# EAGLE schematic mother_board (EAGLE 9.6.0)
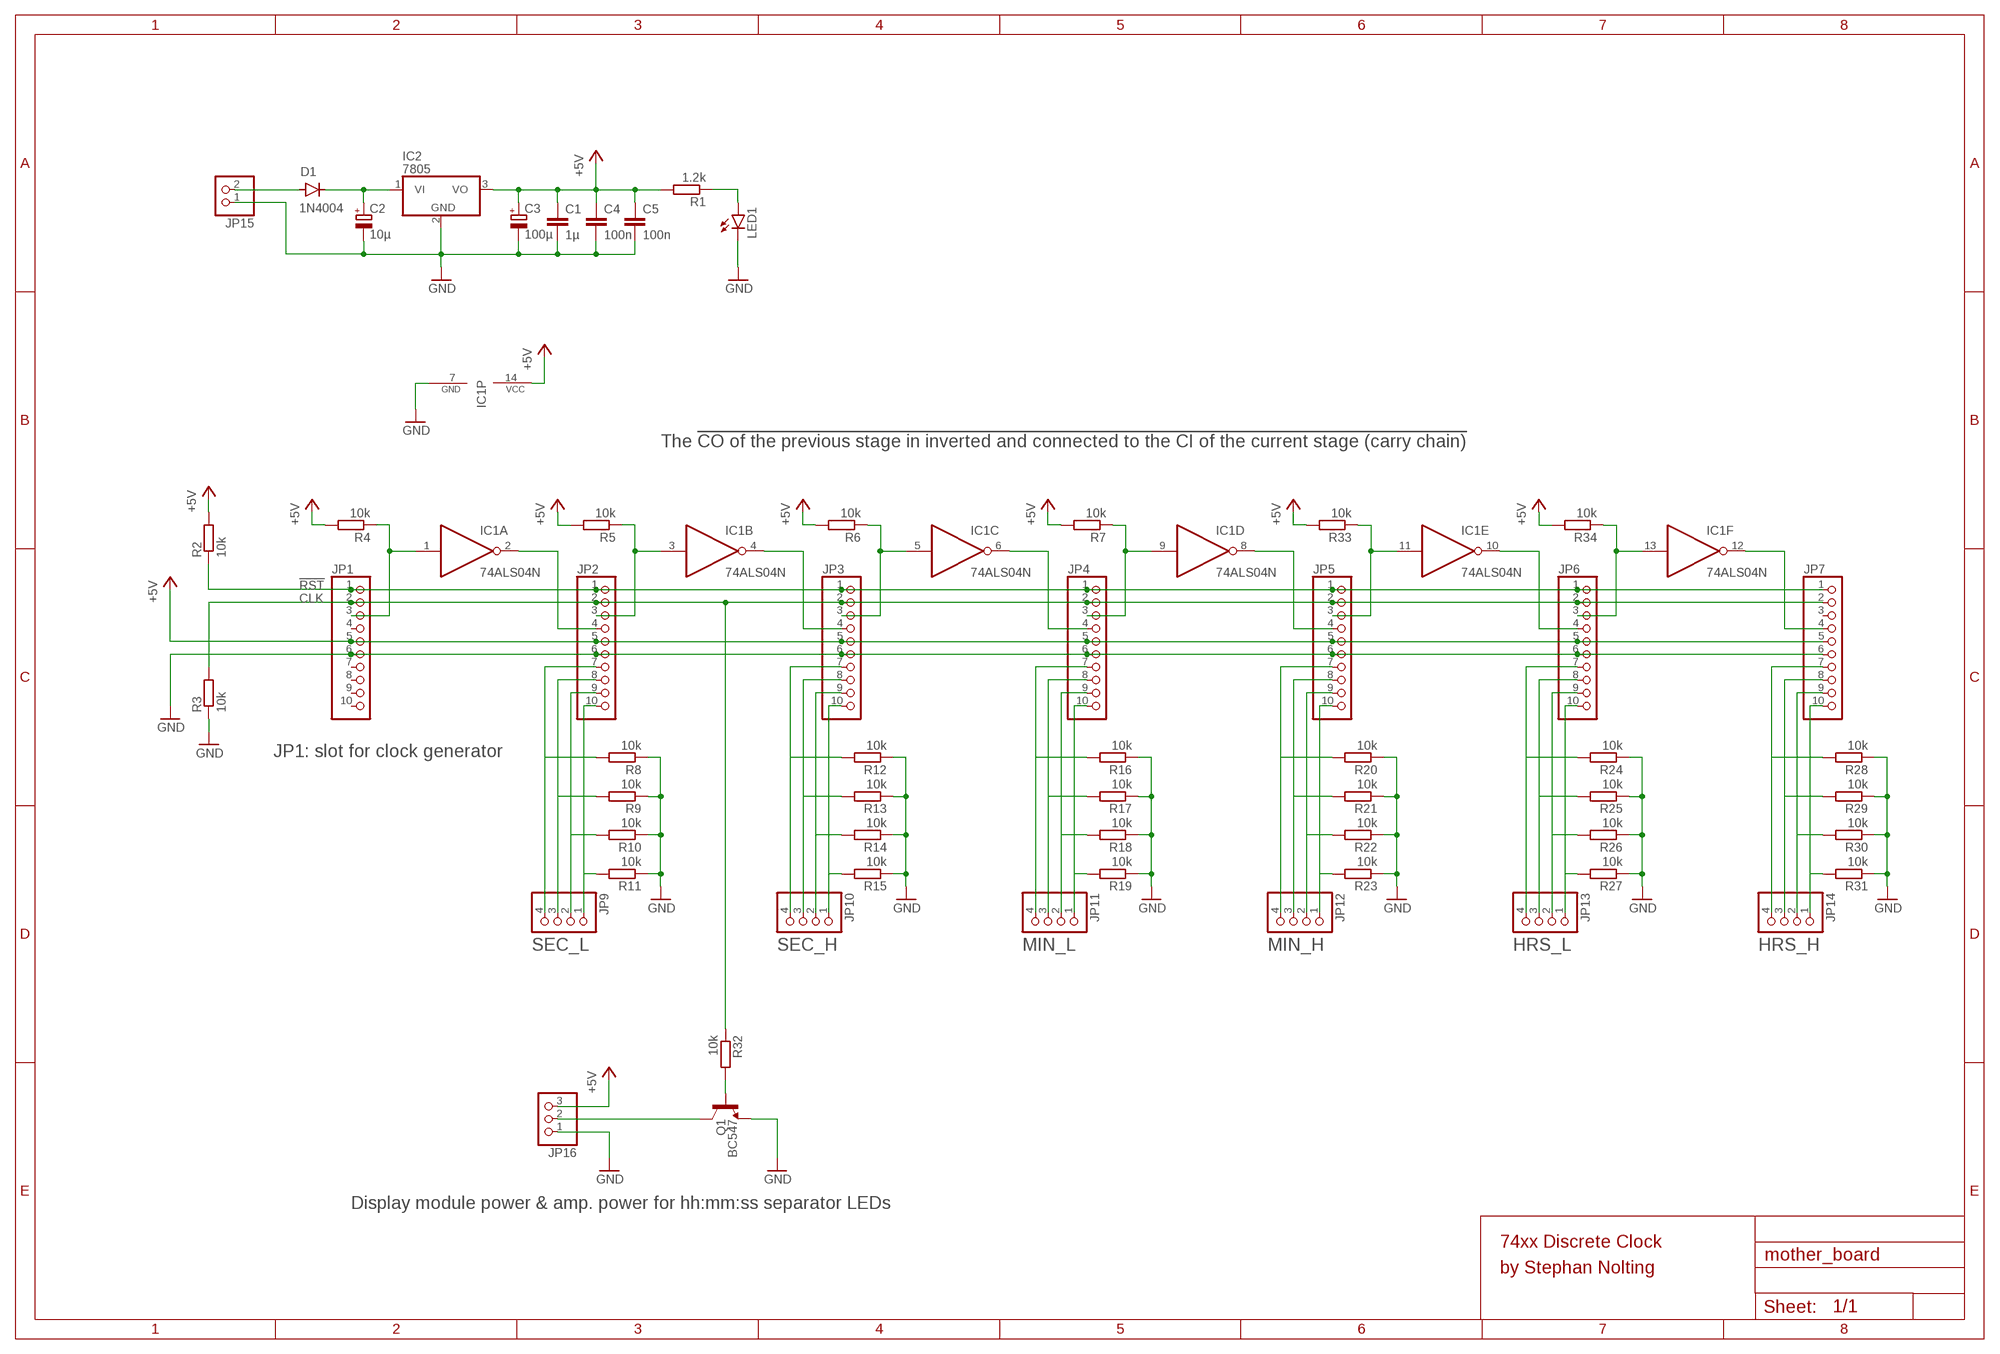
[diagram p0: schematic, sheet 1]

## Parts
C1  1µ  C-EU025-024X044  [C025-024X044]
C2  10µ  CPOL-EUE2-5  [E2-5]
C3  100µ  CPOL-EUE2-5  [E2-5]
C4  100n  C-EU025-024X044  [C025-024X044]
C5  100n  C-EU025-024X044  [C025-024X044]
D1  1N4004  [DO-41]
IC1  74ALS04N  [DIL14]
IC2  7805  788TV  [TO220V]
JP1  PINHD-1X10/90  [1X10/90]
JP2  PINHD-1X10/90  [1X10/90]
JP3  PINHD-1X10/90  [1X10/90]
JP4  PINHD-1X10/90  [1X10/90]
JP5  PINHD-1X10/90  [1X10/90]
JP6  PINHD-1X10/90  [1X10/90]
JP7  PINHD-1X10/90  [1X10/90]
JP9  PINHD-1X4  [1X04]
JP10  PINHD-1X4  [1X04]
JP11  PINHD-1X4  [1X04]
JP12  PINHD-1X4  [1X04]
JP13  PINHD-1X4  [1X04]
JP14  PINHD-1X4  [1X04]
JP15  PINHD-1X2  [1X02]
JP16  PINHD-1X3  [1X03]
LED1  LED3MM  [LED3MM]
Q1  BC547  TRANS_NPN-2N3904  [TO-92]
R1  1.2k  R-EU_0204/7  [0204/7]
R2  10k  R-EU_0204/7  [0204/7]
R3  10k  R-EU_0204/7  [0204/7]
R4  10k  R-EU_0204/7  [0204/7]
R5  10k  R-EU_0204/7  [0204/7]
R6  10k  R-EU_0204/7  [0204/7]
R7  10k  R-EU_0204/7  [0204/7]
R8  10k  R-EU_0204/7  [0204/7]
R9  10k  R-EU_0204/7  [0204/7]
R10  10k  R-EU_0204/7  [0204/7]
R11  10k  R-EU_0204/7  [0204/7]
R12  10k  R-EU_0204/7  [0204/7]
R13  10k  R-EU_0204/7  [0204/7]
R14  10k  R-EU_0204/7  [0204/7]
R15  10k  R-EU_0204/7  [0204/7]
R16  10k  R-EU_0204/7  [0204/7]
R17  10k  R-EU_0204/7  [0204/7]
R18  10k  R-EU_0204/7  [0204/7]
R19  10k  R-EU_0204/7  [0204/7]
R20  10k  R-EU_0204/7  [0204/7]
R21  10k  R-EU_0204/7  [0204/7]
R22  10k  R-EU_0204/7  [0204/7]
R23  10k  R-EU_0204/7  [0204/7]
R24  10k  R-EU_0204/7  [0204/7]
R25  10k  R-EU_0204/7  [0204/7]
R26  10k  R-EU_0204/7  [0204/7]
R27  10k  R-EU_0204/7  [0204/7]
R28  10k  R-EU_0204/7  [0204/7]
R29  10k  R-EU_0204/7  [0204/7]
R30  10k  R-EU_0204/7  [0204/7]
R31  10k  R-EU_0204/7  [0204/7]
R32  10k  R-EU_0204/7  [0204/7]
R33  10k  R-EU_0204/7  [0204/7]
R34  10k  R-EU_0204/7  [0204/7]

## Nets
!RST: JP1.1 JP2.1 JP3.1 JP4.1 JP5.1 JP6.1 JP7.1 R2.1
+5V: C1.1 C3.+ C4.1 C5.1 IC1.14(P:VCC) IC2.3(VO) JP1.5 JP2.5 JP3.5 JP4.5 JP5.5 JP6.5 JP7.5 JP16.3 R1.2 R2.2 R4.2 R5.2 R6.2 R7.2 R33.2 R34.2
CLK: JP1.2 JP2.2 JP3.2 JP4.2 JP5.2 JP6.2 JP7.2 R3.2 R32.1
GND: C1.2 C2.- C3.- C4.2 C5.2 IC1.7(P:GND) IC2.2(GND) JP1.6 JP2.6 JP3.6 JP4.6 JP5.6 JP6.6 JP7.6 JP15.1 JP16.1 LED1.K(C) Q1.1(E) R3.1 R8.1 R9.1 R10.1 R11.1 R12.1 R13.1 R14.1 R15.1 R16.1 R17.1 R18.1 R19.1 R20.1 R21.1 R22.1 R23.1 R24.1 R25.1 R26.1 R27.1 R28.1 R29.1 R30.1 R31.1
N$1: LED1.A R1.1
N$2: JP7.10 JP14.1
N$3: JP7.9 JP14.2
N$4: JP7.8 JP14.3
N$5: JP7.7 JP14.4
N$6: JP6.10 JP13.1
N$7: JP6.9 JP13.2
N$8: JP6.8 JP13.3
N$9: JP6.7 JP13.4
N$10: JP5.10 JP12.1
N$11: JP5.9 JP12.2
N$12: JP5.8 JP12.3
N$13: JP5.7 JP12.4
N$14: JP4.10 JP11.1
N$15: JP16.2 Q1.3(C)
N$16: JP4.9 JP11.2
N$17: JP4.8 JP11.3
N$18: JP4.7 JP11.4
N$19: JP3.10 JP10.1
N$20: JP3.9 JP10.2
N$21: JP3.8 JP10.3
N$22: JP3.7 JP10.4
N$23: JP2.10 JP9.1
N$24: JP2.9 JP9.2
N$25: JP2.8 JP9.3
N$26: JP2.7 JP9.4
N$31: R11.2
N$32: R10.2
N$33: R9.2
N$34: R8.2
N$35: R15.2
N$36: R14.2
N$37: R13.2
N$38: R12.2
N$39: R19.2
N$40: R18.2
N$41: R17.2
N$42: R16.2
N$43: R23.2
N$44: R22.2
N$45: R21.2
N$46: R20.2
N$47: R27.2
N$48: R26.2
N$49: R25.2
N$50: R24.2
N$51: R31.2
N$52: R30.2
N$53: R29.2
N$54: R28.2
N$55: IC1.1(A:I) JP1.3 R4.1
N$56: IC1.2(A:O) JP2.4
N$57: IC1.3(B:I) JP2.3 R5.1
N$58: IC1.4(B:O) JP3.4
N$59: IC1.5(C:I) JP3.3 R6.1
N$60: IC1.6(C:O) JP4.4
N$61: IC1.9(D:I) JP4.3 R7.1
N$62: IC1.8(D:O) JP5.4
N$63: IC1.11(E:I) JP5.3 R33.1
N$64: IC1.10(E:O) JP6.4
N$65: IC1.13(F:I) JP6.3 R34.1
N$66: IC1.12(F:O) JP7.4
N$67: D1.A JP15.2
N$68: C2.+ D1.C IC2.1(VI)
N$69: Q1.2(B) R32.2
Unconnected: JP1.4 JP1.7 JP1.8 JP1.9 JP1.10 JP7.3

## Notes on the sheet
- The !CO of the previous stage in inverted and connected to the CI of the current stage (carry chain)
- JP1: slot for clock generator
- SEC_L | SEC_H | MIN_L | MIN_H | HRS_L | HRS_H
- Display module power & amp. power for hh:mm:ss separator LEDs
- 74xx Discrete Clock
- by Stephan Nolting

## Library data of the parts
C1 C4 C5 = rcl:C-EU: CAPACITOR, European symbol; SPICEPREFIX: C
C2 C3 = rcl:CPOL-EU: POLARIZED CAPACITOR, European symbol; SPICEPREFIX: C
D1 = Diodes:1N4004: DIODE GEN PURP 400V 1A DO41 Manufacturer's datasheet <https://www.mccsemi.com/pdf/Products/1N4001-1N4007(DO-41).pdf>; CREATED_BY: PCBLayout.com; DIGIKEY_PART_NUMBER: 1N4004MSCT-ND; MANUFACTURER: Micro Commercial Co; MPN: 1N4004; PACKAGE: DO-41
IC1 = 74xx-us:74*04: Hex INVERTER
IC2 = linear:78*: Positive VOLTAGE REGULATOR Source: http://cache.national.com/ds/LM/LM78L05.pdf http://www.fairchildsemi.com/ds/LM/LM7805.pdf
JP1-JP7 = pinhead:PINHD-1X10: PIN HEADER
JP9-JP14 = pinhead:PINHD-1X4: PIN HEADER
JP15 = pinhead:PINHD-1X2: PIN HEADER
JP16 = pinhead:PINHD-1X3: PIN HEADER
LED1 = led:LED: LED OSRAM: - CHIPLED LG R971, LG N971, LY N971, LG Q971, LY Q971, LO R971, LY R971 LH N974, LH R974 LS Q976, LO Q976, LY Q976 LO Q996 - Hyper CHIPLED LW Q18S LB Q993, LB Q99A, LB R99A - SideLED LS A670, LO A670, LY A670, LG A670, LP A670 LB A673, LV A673, LT A673, LW A673 LH A674 LY A675 LS A676, LA A676, LO A676, LY A676, LW A676 LS A679, LY A679, LG A679 - Hyper Micro SIDELED® LS Y876, LA Y876, LO Y876, LY Y876 LT Y87S - SmartLED LW L88C, LW L88S LB L89C, LB L89S, LG L890 LS L89K, LO L89K, LY L89K LS L896, LA L896, LO L896, LY L896 - TOPLED LS T670, LO T670, LY T670, LG T670, LP T670 LSG T670, LSP T670, LSY T670, LOP T670, LYG T670 LG T671, LOG T671, LSG T671 LB T673, LV T673, LT T673, LW T673 LH T674 LS T676, LA T676, LO T676, LY T676, LB T676, LH T676, LSB T676, LW T676 LB T67C, LV T67C, LT T67C, LS T67K, LO T67K, LY T67K, LW E67C LS E67B, LA E67B, LO E67B, LY E67B, LB E67C, LV E67C, LT E67C LW T67C LS T679, LY T679, LG T679 LS T770, LO T770, LY T770, LG T770, LP T770 LB T773, LV T773, LT T773, LW T773 LH T774 LS E675, LA E675, LY E675, LS T675 LS T776, LA T776, LO T776, LY T776, LB T776 LHGB T686 LT T68C, LB T68C - Hyper Mini TOPLED® LB M676 - Mini TOPLED Santana® LG M470 LS M47K, LO M47K, LY M47K Source: http://www.osram.convergy.de LUXEON: - LUMILED® LXK2-PW12-R00, LXK2-PW12-S00, LXK2-PW14-U00, LXK2-PW14-V00 LXK2-PM12-R00, LXK2-PM12-S00, LXK2-PM14-U00 LXK2-PE12-Q00, LXK2-PE12-R00, LXK2-PE12-S00, LXK2-PE14-T00, LXK2-PE14-U00 LXK2-PB12-K00, LXK2-PB12-L00, LXK2-PB12-M00, LXK2-PB14-N00, LXK2-PB14-P00, LXK2-PB14-Q00 LXK2-PR12-L00, LXK2-PR12-M00, LXK2-PR14-Q00, LXK2-PR14-R00 LXK2-PD12-Q00, LXK2-PD12-R00, LXK2-PD12-S00 LXK2-PH12-R00, LXK2-PH12-S00 LXK2-PL12-P00, LXK2-PL12-Q00, LXK2-PL12-R00 Source: www.luxeon.com KINGBRIGHT: KA-3528ASYC Source: www.kingbright.com
Q1 = SparkFun-DiscreteSemi:TRANS_NPN: NPN transistor Current controlled devices typically used to amplify current or used as a switch. BC547 - COM-08928 <http://www.sparkfun.com/products/8928> (TO-92 45V 100mA) (1.Collector 2.Base 3.Emitter) 2N3904 - COM-00521 <http://www.sparkfun.com/products/521> (TO-92 40V 200mA) (1.Emitter 2.Base 3.Collector) P2N2222A - COM-12852 <http://www.sparkfun.com/products/12852> (TO-92 40V 600mA) (1.Collector 2.Base 3.Emitter); PROD_ID: TRANS-08447; VALUE: 200mA/40V
R1-R34 = rcl:R-EU_: RESISTOR, European symbol; SPICEPREFIX: R